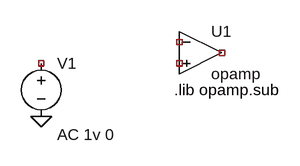
[diagram p0: schematic TP2_3_2.asc]
TP2_3_2.asc, the LTspice schematic file:
Version 4
SHEET 1 880 680
FLAG -16 256 0
SYMBOL Opamps\\opamp 224 96 R0
SYMATTR InstName U1
SYMBOL voltage -16 160 R0
WINDOW 123 24 124 Left 2
WINDOW 39 0 0 Left 0
SYMATTR InstName V1
SYMATTR Value ""
SYMATTR Value2 AC 1v 0
TEXT 184 216 Left 2 !.lib opamp.sub

The netlist it stands for:
* TP2_3_2.asc
XU1 NC_01 NC_02 NC_03 opamp Aol=100K GBW=10Meg  ; pins invin noninvin out
V1 NC_04 0 AC 1v 0
.lib opamp.sub
.backanno
.end